# Altium schematic sheet main.SchDoc: Abacus main pcb
size A4; DrawnBy: Posheng Cheng; DocumentNumber: 1; SheetNumber: 1; SheetTotal: 4; SPICEModelCacheAYXZMGLR: <root> / <DocumentId>AYXZMGLR</DocumentId> / <CacheFrame Number="0"> / <Model Name="865080340001_10uf" Kind="CKT"> / <Text>******* / .subckt 865080340001_10uF 1 2 / Rser 1 3 1.3 / Lser 2 4 6.62786597E-10 / C1 3 4 0.00001 / Rpar 3 4 5333333.33333333 / .ends 865080340001_10uF</Text> / </Model> / </CacheFrame> / </root>
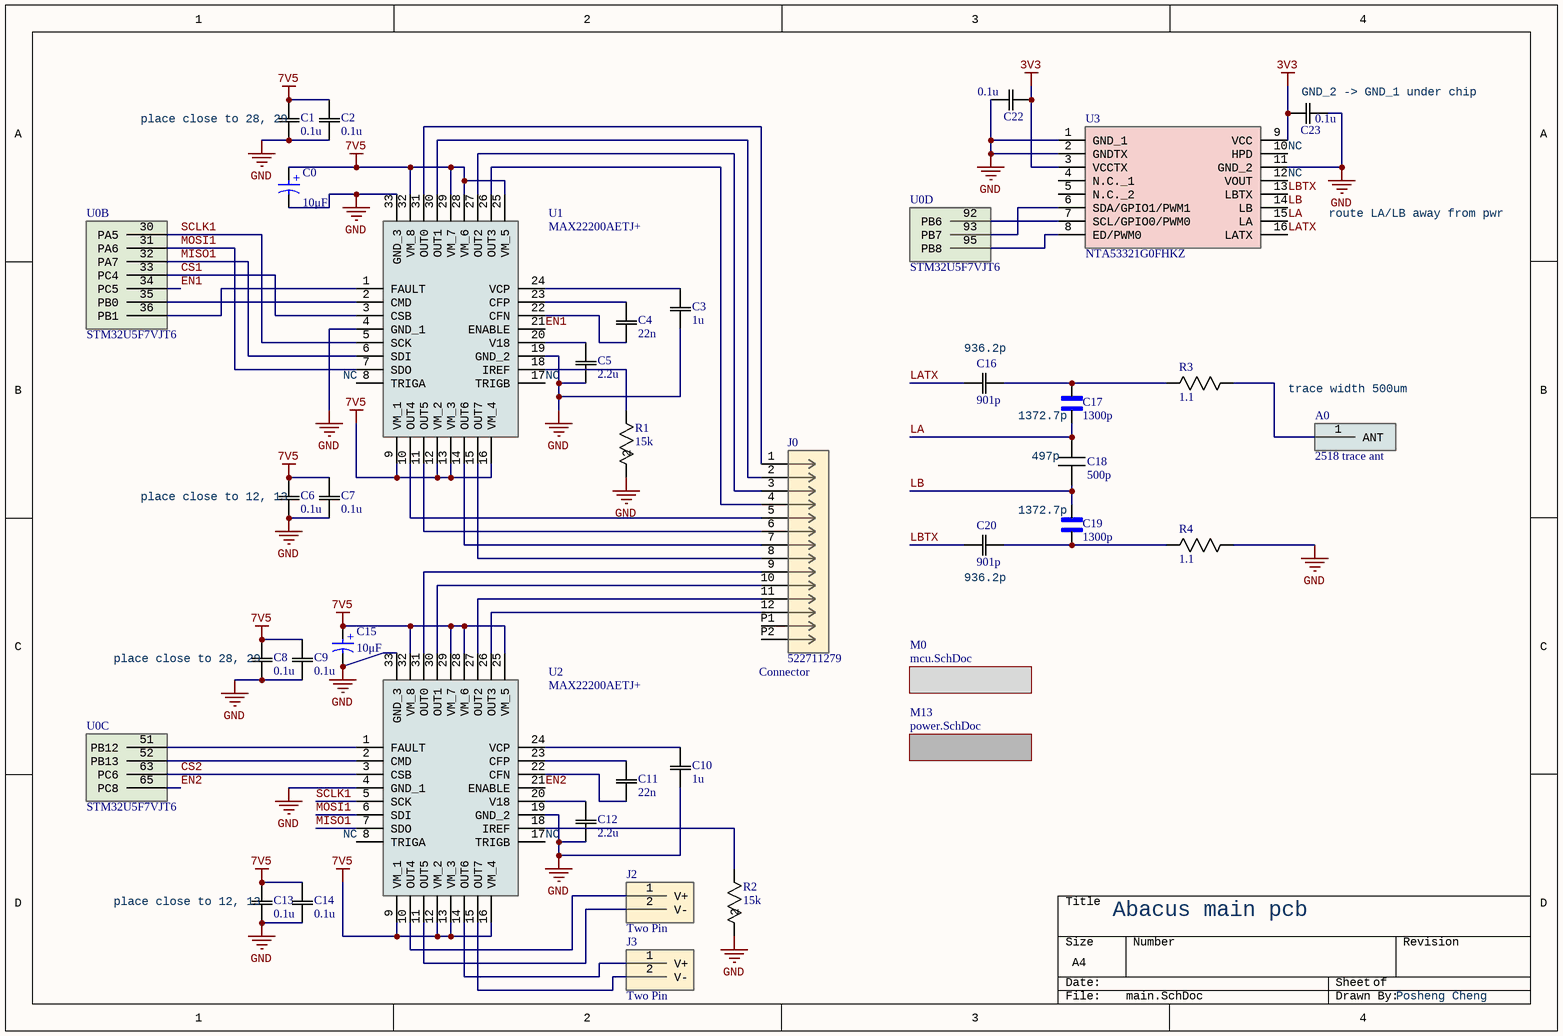
[diagram p0: main.SchDoc]

## Parts
(Parts that share a designator on the sheet are numbered #1, #2 ... from top to bottom, then left to right.)
A0  2518 trace ant  [NFCANT]
C0  10μF  [WCAP-ASLI_D4H5.5]
C1  0.1u  [CAP_CC0201_YAG]
C2  0.1u  [CAP_CC0201_YAG]
C3  1u  [CAP_CC0201_YAG]
C4  22n  [CAP_CC0201_YAG]
C5  2.2u  [CAP_CC0201_YAG]
C6  0.1u  [CAP_CC0201_YAG]
C7  0.1u  [CAP_CC0201_YAG]
C8  0.1u  [CAP_CC0201_YAG]
C9  0.1u  [CAP_CC0201_YAG]
C10  1u  [CAP_CC0201_YAG]
C11  22n  [CAP_CC0201_YAG]
C12  2.2u  [CAP_CC0201_YAG]
C13  0.1u  [CAP_CC0201_YAG]
C14  0.1u  [CAP_CC0201_YAG]
C15  10μF  [WCAP-ASLI_D4H5.5]
C16  901p  [CAPC17595_87N_KEM]
C17  1300p  [CAPC1608X95N]
C18  500p  [CAPC17595_87N_KEM]
C19  1300p  [CAPC1608X95N]
C20  901p  [CAPC17595_87N_KEM]
C22  0.1u  [CAP_CC0201_YAG]
C23  0.1u  [CAP_CC0201_YAG]
J0  522711279  System: Connector  [CON_522711279_MOL]
J2  Two Pin  [TWO_PIN]
J3  Two Pin  [TWO_PIN]
R1  15k  [RC0603N_PAN]
R2  15k  [RC0603N_PAN]
R3  1.1  [RC0603N_PAN]
R4  1.1  [RC0603N_PAN]
U0#1  STM32U5F7VJT6  [QFP50P1600X1600X160-100N]  (part D of 4)
U0#2  STM32U5F7VJT6  [QFP50P1600X1600X160-100N]  (part B of 2)
U0#3  STM32U5F7VJT6  [QFP50P1600X1600X160-100N]  (part C of 3)
U1  MAX22200AETJ+  [QFN50P500X500X80-33N]
U2  MAX22200AETJ+  [QFN50P500X500X80-33N]
U3  NTA53321G0FHKZ  [NTA53321G0FHKZ]

## Sub-sheets
M0 = mcu.SchDoc: no entries
M13 = power.SchDoc: no entries

## Nets
3V3: C22.2 C23.1 U3.3(VCCTX) U3.9(VCC)
7V5: C0.1(P) C1.2 C2.2 C6.2 C7.2 C8.2 C9.2 C13.2 C14.2 C15.1(P) U1.9(VM_1) U1.12(VM_2) U1.13(VM_3) U1.16(VM_4) U1.25(VM_5) U1.28(VM_6) U1.29(VM_7) U1.32(VM_8) U2.9(VM_1) U2.12(VM_2) U2.13(VM_3) U2.16(VM_4) U2.25(VM_5) U2.28(VM_6) U2.29(VM_7) U2.32(VM_8)
GND: C0.2(N) C1.1 C2.1 C3.1 C5.1 C6.1 C7.1 C8.1 C9.1 C10.1 C12.1 C13.1 C14.1 C15.2(N) C22.1 C23.2 R1.2 R2.2 R4.1 U1.4(GND_1) U1.19(GND_2) U1.33(GND_3) U2.4(GND_1) U2.19(GND_2) U2.33(GND_3) U3.1(GND_1) U3.2(GNDTX) U3.11(GND_2)
CS1: U0#2.33(PC4) U1.3(CSB)
CS2: U0#3.63(PC6) U2.3(CSB)
EN1: U0#2.34(PC5) U1.21(ENABLE)
EN2: U0#3.65(PC8) U2.21(ENABLE)
LA: C17.1 C18.2 U3.15(LA)
LATX: C16.2 U3.16(LATX)
LB: C18.1 C19.2 U3.14(LB)
LBTX: C20.2 U3.13(LBTX)
MISO1: U0#2.32(PA7) U1.6(SDI) U2.7(SDO)
MOSI1: U0#2.31(PA6) U1.7(SDO) U2.6(SDI)
SCLK1: U0#2.30(PA5) U1.5(SCK) U2.5(SCK)
NetA0_1: A0.1(ANT) R3.1
NetC3_2: C3.2 U1.24(VCP)
NetC4_1: C4.1 U1.22(CFN)
NetC4_2: C4.2 U1.23(CFP)
NetC5_2: C5.2 U1.20(V18)
NetC10_2: C10.2 U2.24(VCP)
NetC11_1: C11.1 U2.22(CFN)
NetC11_2: C11.2 U2.23(CFP)
NetC12_2: C12.2 U2.20(V18)
NetC16_1: C16.1 C17.2 R3.2
NetC19_1: C19.1 C20.1 R4.2
NetJ0_1: J0.1 U1.31(OUT0)
NetJ0_2: J0.2 U1.30(OUT1)
NetJ0_3: J0.3 U1.27(OUT2)
NetJ0_4: J0.4 U1.26(OUT3)
NetJ0_5: J0.5 U1.10(OUT4)
NetJ0_6: J0.6 U1.11(OUT5)
NetJ0_7: J0.7 U1.14(OUT6)
NetJ0_8: J0.8 U1.15(OUT7)
NetJ0_9: J0.9 U2.31(OUT0)
NetJ0_10: J0.10 U2.30(OUT1)
NetJ0_11: J0.11 U2.27(OUT2)
NetJ0_12: J0.12 U2.26(OUT3)
NetJ2_1: J2.1(V+) U2.10(OUT4)
NetJ2_2: J2.2(V-) U2.11(OUT5)
NetJ3_1: J3.1(V+) U2.14(OUT6)
NetJ3_2: J3.2(V-) U2.15(OUT7)
NetR1_1: R1.1 U1.18(IREF)
NetR2_1: R2.1 U2.18(IREF)
NetU0#1_92: U0#1.92(PB6) U3.7(SCL/GPIO0/PWM0)
NetU0#1_93: U0#1.93(PB7) U3.6(SDA/GPIO1/PWM1)
NetU0#1_95: U0#1.95(PB8) U3.8(ED/PWM0)
NetU0#2_35: U0#2.35(PB0) U1.2(CMD)
NetU0#2_36: U0#2.36(PB1) U1.1(FAULT)
NetU0#3_51: U0#3.51(PB12) U2.1(FAULT)
NetU0#3_52: U0#3.52(PB13) U2.2(CMD)

Not connected (* = marked no-connect by the designer): J0 P1 P2; U1 8(TRIGA) 17(TRIGB); U2 8(TRIGA) 17(TRIGB); U3 4(N.C._1) 5(N.C._2) 10(HPD) 12(VOUT)

## Notes on the sheet
- (near C23) GND_2 -> GND_1 under chip
- (near C1) place close to 28, 29
- (near U3) NC
- NC
- route LA/LB away from pwr
- (near U1) NC
- (near C16) 936.2p
- (near C17) 1372.7p
- (near A0) trace width 500um
- (near C6) place close to 12, 13
- (near C19) 1372.7p
- (near C18) 497p
- (near C20) 936.2p
- (near C8) place close to 28, 29
- (near U2) NC
- (near C13) place close to 12, 13
- (in symbol 865080340001) +

## Library data of the parts
A0 = Component_1
C0 C15 = 865080340001: WCAP-ASLI Aluminum Electrolytic Capacitor, V-Chip, SMT, 4mm x 5.5mm, 10μF, 16V; Manufacturer: Wurth Elektronik; Dissipation Factor: 16%; Endurance: 2000h; Impedance: 2200mΩ; Leakage Current: 3μA; Ripple Current: 80mA; Manufacturer_Part_Number: 865080340001; Category: Aluminum Electrolytic Capacitors; Match Code: WCAP-ASLI; ComponentLink1Description: Website Link; ComponentLink1URL: https://www.we-online.com/redexpert/article/865080340001?ad; ComponentLink2Description: Datasheet Link; ComponentLink2URL: https://www.we-online.com/redexpert/spec/865080340001?ad; Mount: Surface Mount; Min Operating Temperature: -55°C; Max Operating Temperature: 105°C; Packaging: Tape and Reel; Height: 5.5mm; Diameter: 4mm; Capacitance: 10μF; Rated Voltage (DC): 16V
C1 C2 C6-C9 C13 C14 = CC0201KRX5R7BB104: Description; Manufacturer_Name: Yageo; Copyright: Copyright (C) 2025 Ultra Librarian. All rights reserved.; Manufacturer_Part_Number: CC0201KRX5R7BB104
C3 C10 = CC0201MRX5R5BB105: No Description Available; Manufacturer_Name: Yageo; Copyright: Copyright (C) 2025 Ultra Librarian. All rights reserved.; Manufacturer_Part_Number: CC0201MRX5R5BB105
C4 C11 = CC0201KRX5R7BB223: No Description Available; Manufacturer_Name: Yageo; Copyright: Copyright (C) 2025 Ultra Librarian. All rights reserved.; Manufacturer_Part_Number: CC0201KRX5R7BB223
C5 C12 = CC0201MRX5R5BB225: No Description Available; Manufacturer_Name: Yageo; Copyright: Copyright (C) 2025 Ultra Librarian. All rights reserved.; Manufacturer_Part_Number: CC0201MRX5R5BB225
C16 C20 = C0603C911F5GACTU: SMD Comm C0G, Ceramic, 910 pF, 1%, 50 VDC, C0G, SMD, MLCC, Ultra-Stable, Low Loss, Class I, 0603; Manufacturer_Name: Kemet; Copyright: Copyright (C) 2025 Ultra Librarian. All rights reserved.; Manufacturer_Part_Number: C0603C911F5GACTU; Datasheet: https://content.kemet.com/datasheets/KEM_C1003_C0G_SMD.pdf
C17 C19 = C0603X132F4HACTU: CAP CER 0603 1.3NF 16V ULTRA STA; MF: KEMET; MP: C0603X132F4HAC7867; SnapEDA_Link: https://www.snapeda.com/parts/C0603X132F4HAC7867/KEMET/view-part/?ref=snap; Package: 1608 KEMET; Value: *; Check_prices: https://www.snapeda.com/parts/C0603X132F4HAC7867/KEMET/view-part/?ref=eda; Manufacturer_Part_Number: C0603X132F4HACTU
C18 = CC0603JRNPO9BN501: CC0603JRNPO9BN501 500pF 5%, 50 VDC 0603; Manufacturer_Part_Number: CC0603JRNPO9BN501
C22 C23 = CMP-001-00086-1: Description; Manufacturer_Name: Yageo; Copyright: Copyright (C) 2025 Ultra Librarian. All rights reserved.; Design Item ID: CC0201KRX5R7BB104; Manufacturer_Part_Number: CC0201KRX5R7BB104; Source: CC0201KRX5R7BB104.SchLib
J0 = 522711279: Easy-On FFC/FPC Connector, 1.00mm Pitch, Slider Series, Right-Angle, Bottom Contact, 3.00mm Height, 12 Circuits, Tin-Bismuth Plating; Manufacturer_Name: Molex Connector Corporation; Copyright: Copyright (C) 2025 Ultra Librarian. All rights reserved.; Manufacturer_Part_Number: 522711279; RefDes: RefDes; Type: Type
J2 J3 = two_pin
R1 R2 = ERA-3AEB153V: No Description Available; Manufacturer_Name: Panasonic; Copyright: Copyright (C) 2025 Ultra Librarian. All rights reserved.; Manufacturer_Part_Number: ERA-3AEB153V
R3 R4 = RT0603DRE071R1L: YAGEO, RT, Thin Film, SMD Chip, 1.1 Ohms, 0.5%, 0603 / 1608; Copyright: Copyright (C) 2025 Ultra Librarian. All rights reserved.; Manufacturer_Name: YAGEO; Manufacturer_Part_Number: RT0603DRE071R1L
U0#1-U0#3 = STM32U5F7VJT6: Advanced Graphics and Ultra Low Power  CortexM-33 with Trustzone, NEOCHROM VG GPU, 160MHZ, with 3 MBSRAM and 4M of Flash.; Manufacturer_Name: STMicroelectronics; Geometry.Height: 1.6mm; Manufacturer_Part_Number: STM32U5F7VJT6; Mouser Part Number: 511-STM32U5F7VJT6; Mouser Price/Stock: https://www.mouser.co.uk/ProductDetail/STMicroelectronics/STM32U5F7VJT6?qs=HoCaDK9Nz5e1ZGsW1DPWFA%3D%3D; Arrow Part Number: STM32U5F7VJT6; Arrow Price/Stock: https://www.arrow.com/en/products/stm32u5f7vjt6/stmicroelectronics?region=nac; Datasheet Link: https://www.st.com/resource/en/datasheet/stm32u5f7vj.pdf
U1 U2 = MAX22200AETJ+: Motor/Motion/Ignition Controllers & Drivers 36V, 1A Octal Integrated Serial-Controll; Manufacturer_Name: Analog Devices; Geometry.Height: 0.8mm; Manufacturer_Part_Number: MAX22200AETJ+; Mouser Part Number: *; Mouser Price/Stock: *; Arrow Part Number: MAX22200AETJ+; Arrow Price/Stock: https://www.arrow.com/en/products/max22200aetj/analog-devices?utm_currency=USD&region=nac; Datasheet Link: https://www.analog.com/media/en/technical-documentation/data-sheets/MAX22200.pdf
U3 = NTA53321G0FHKZ: Interface - Specialized NTAG; Manufacturer_Name: NXP; Geometry.Height: 0.5mm; Manufacturer_Part_Number: NTA53321G0FHKZ; Mouser Part Number: 771-NTA53321G0FHKZ; Mouser Price/Stock: https://www.mouser.co.uk/ProductDetail/NXP-Semiconductors/NTA53321G0FHKZ?qs=OlC7AqGiEDk3OpnM8pXHAA%3D%3D; Arrow Part Number: NTA53321G0FHKZ; Arrow Price/Stock: https://www.arrow.com/en/products/nta53321g0fhkz/nxp-semiconductors?region=nac; Datasheet Link: https://www.mouser.co.il/datasheet/2/302/NTA5332-1815294.pdf